# Altium schematic sheet 继电器功率驱动输出.SchDoc: 继电器输出
size A4; Author: GAOYANG; Organization: Altium Limited; Address1: L3, 12a Rodborough Rd; Address2: Frenchs Forest; Address3: NSW; Address4: Australia 2086
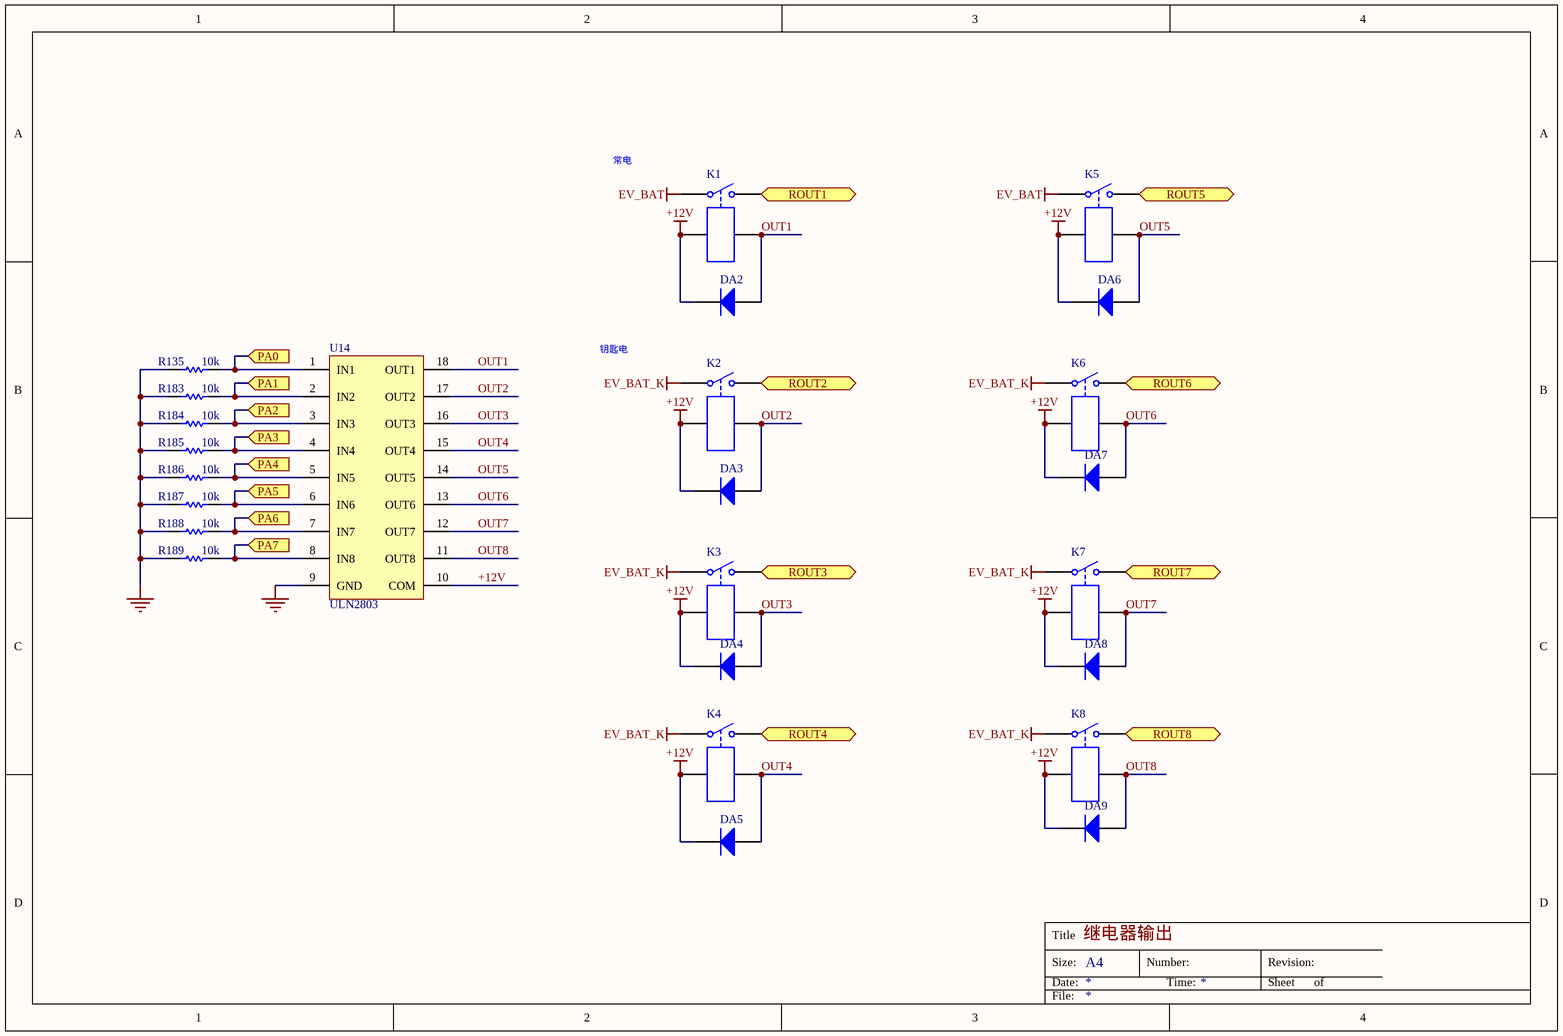
[diagram p0: 继电器功率驱动输出.SchDoc]

## Parts
DA2  Diode 1N4148  [SMB]  (value not drawn)
DA3  Diode 1N4148  [SMB]  (value not drawn)
DA4  Diode 1N4148  [SMB]  (value not drawn)
DA5  Diode 1N4148  [SMB]  (value not drawn)
DA6  Diode 1N4148  [SMB]  (value not drawn)
DA7  Diode 1N4148  [SMB]  (value not drawn)
DA8  Diode 1N4148  [SMB]  (value not drawn)
DA9  Diode 1N4148  [SMB]  (value not drawn)
K1  Relay-SPST  [继电器宏发]  (value not drawn)
K2  Relay-SPST  [继电器宏发]  (value not drawn)
K3  Relay-SPST  [继电器宏发]  (value not drawn)
K4  Relay-SPST  [继电器宏发]  (value not drawn)
K5  Relay-SPST  [继电器宏发]  (value not drawn)
K6  Relay-SPST  [继电器宏发]  (value not drawn)
K7  Relay-SPST  [继电器宏发]  (value not drawn)
K8  Relay-SPST  [继电器宏发]  (value not drawn)
R135  value 10k  [0603-Resistor]  (hidden comment: RT0603BRD0710KL)
R183  value 10k  [0603-Resistor]  (hidden comment: RT0603BRD0710KL)
R184  value 10k  [0603-Resistor]  (hidden comment: RT0603BRD0710KL)
R185  value 10k  [0603-Resistor]  (hidden comment: RT0603BRD0710KL)
R186  value 10k  [0603-Resistor]  (hidden comment: RT0603BRD0710KL)
R187  value 10k  [0603-Resistor]  (hidden comment: RT0603BRD0710KL)
R188  value 10k  [0603-Resistor]  (hidden comment: RT0603BRD0710KL)
R189  value 10k  [0603-Resistor]  (hidden comment: RT0603BRD0710KL)
U14  ULN2803  [U14]

## Ports
PA0 (in), PA1 (in), PA2 (in), PA3 (in), PA4 (in), PA5 (in), PA6 (in), PA7 (in), ROUT1 (out), ROUT2 (out), ROUT3 (out), ROUT4 (out), ROUT5 (out), ROUT6 (out), ROUT7 (out), ROUT8 (out)

## Nets
+12V: DA2.2(K) DA3.2(K) DA4.2(K) DA5.2(K) DA6.2(K) DA7.2(K) DA8.2(K) DA9.2(K) K1.3 K2.3 K3.3 K4.3 K5.3 K6.3 K7.3 K8.3 U14.10(COM)
EV_BAT: K1.1 K5.1
EV_BAT_K: K2.1 K3.1 K4.1 K6.1 K7.1 K8.1
GND: R135.1 R183.1 R184.1 R185.1 R186.1 R187.1 R188.1 R189.1 U14.9(GND)
OUT1: DA2.1(A) K1.4 U14.18(OUT1)
OUT2: DA3.1(A) K2.4 U14.17(OUT2)
OUT3: DA4.1(A) K3.4 U14.16(OUT3)
OUT4: DA5.1(A) K4.4 U14.15(OUT4)
OUT5: DA6.1(A) K5.4 U14.14(OUT5)
OUT6: DA7.1(A) K6.4 U14.13(OUT6)
OUT7: DA8.1(A) K7.4 U14.12(OUT7)
OUT8: DA9.1(A) K8.4 U14.11(OUT8)
PA0: R135.2 U14.1(IN1) ; port PA0
PA1: R183.2 U14.2(IN2) ; port PA1
PA2: R184.2 U14.3(IN3) ; port PA2
PA3: R185.2 U14.4(IN4) ; port PA3
PA4: R186.2 U14.5(IN5) ; port PA4
PA5: R187.2 U14.6(IN6) ; port PA5
PA6: R188.2 U14.7(IN7) ; port PA6
PA7: R189.2 U14.8(IN8) ; port PA7
ROUT1: K1.2 ; port ROUT1
ROUT2: K2.2 ; port ROUT2
ROUT3: K3.2 ; port ROUT3
ROUT4: K4.2 ; port ROUT4
ROUT5: K5.2 ; port ROUT5
ROUT6: K6.2 ; port ROUT6
ROUT7: K7.2 ; port ROUT7
ROUT8: K8.2 ; port ROUT8

## Notes on the sheet
- 常电
- 钥匙电
- Title
- Size:
- Date:
- A4
- Number:
- Time:
- Revision:
- Sheet
- of
- File:

## Library data of the parts
DA2-DA9 = Diode 1N4148: High Conductance Fast Diode; Published: 8-Jun-2000; LatestRevisionDate: 17-Jul-2002; LatestRevisionNote: Re-released for DXP Platform.; DatasheetVersion: 1997; PackageReference: DO-35; Publisher: Altium Limited; PackageDescription: Diode, Axial; Body 3.8 x 1.9 mm (LxDia. max), Lead Dia. 0.53 mm (max); Code_JEDEC: DO-204-AH; ComponentLink1Description: Manufacturer Link; ComponentLink1URL: http://www.fairchildsemi.com/; ComponentLink2Description: Datasheet; ComponentLink2URL: http://www.fairchildsemi.com/ds/1N%2F1N4148.pdf
K1-K8 = Relay-SPST: Single-Pole Single-Throw Relay; Published: 24-Mar-1999; LatestRevisionDate: 17-Jul-2002; LatestRevisionNote: Re-released for DXP Platform.; PackageReference: MODULE4; Publisher: Altium Limited
R135 R183-R189 = RT0603BRD0710KL: RES, 10k ohm, 0.1%, 0.1W, 0603; Manufacturer: YAGEO; CompType: Resistor; Polarized: N; TempCo_ppm/C: 25; Tolerance_%: 0.1; U/M: EA; Vaule_DC: 75; Packaging Type: Paper taping reel; Value_Current: 1A; ComponentLink1URL: http://www.yageo.com/NewPortal/yageo?service=application&layer1=Consumer%20Electronics&lang=en#; Res_ohm: 10k; LatestRevisionDate: 2016-06-12; LatestRevisionNote: AddComment; MountType: SMT; PackageReference: 0603; PartNumber: RT0603BRD0710KL; Published: 2016-01-22; Publisher: YAGEO; RoHS: Y; Supplier 1: TL; Supplier Part Number: RT0603BRD0710KL; SymbolVerision: 2016-06-12; Technology: Thick Film; Value_Tolerance: 0.1%; Value_Power: 0.1W; Value_Code: 10k; Automotive: N; Rated Current: 1A; ComponentLink1Description: Component introduction